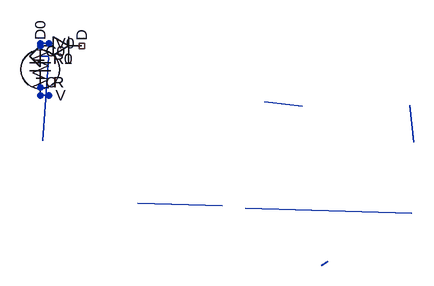
[diagram p0: schematic try6..asc]
try6..asc, the LTspice schematic file:
Version 4
SHEET 1 880 680
WIRE -1 -17 12 -17
WIRE -1 47 12 47
WIRE -1 -21 12 -21
WIRE -1 59 12 59
WIRE -1 -1 12 -1
WIRE -1 -1 12 -1
WIRE -1 -17 12 -17
WIRE -1 47 12 47
WIRE -1 -21 12 -21
WIRE -1 59 12 59
WIRE -1 -21 12 -21
WIRE -1 59 12 59
WIRE 432 321 442 314
WIRE 571 240 315 233
WIRE 403 76 344 69
WIRE 574 131 568 74
WIRE 280 229 149 225
WIRE 12 0 3 129
SYMBOL cap -17 -17 R0
SYMATTR InstName C0
SYMBOL voltage -1 -37 R0
SYMATTR InstName V0
FLAG -1 -1 0
SYMBOL diode -1 -1 R270
SYMATTR InstName D0
SYMBOL res -17 -37 R0
SYMATTR InstName R0
SYMBOL res -17 -37 R0
SYMATTR InstName R1

The netlist it stands for:
* try6..asc
C0 N001 N002 C
V0 N003 N004 V
D0 N001 NC_01 D
R0 N003 N004 R
R1 N003 N004 R
.model D D
.lib standard.dio
.backanno
.end